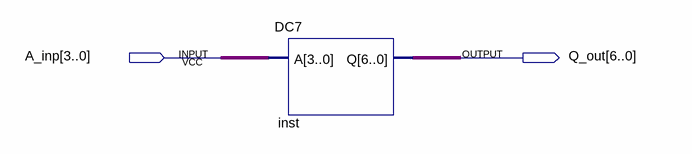
[diagram p0: schematic sheet]
// Quartus schematic Block1.bdf as structural Verilog: 1 symbols, 2 pins
module Block1 (
  input  [3:0] A_inp,
  output [6:0] Q_out
);

  DC7 inst (.A(A_inp), .Q(Q_out));
endmodule
